# EAGLE design localization-daughter-board (EAGLE 8.6.0)
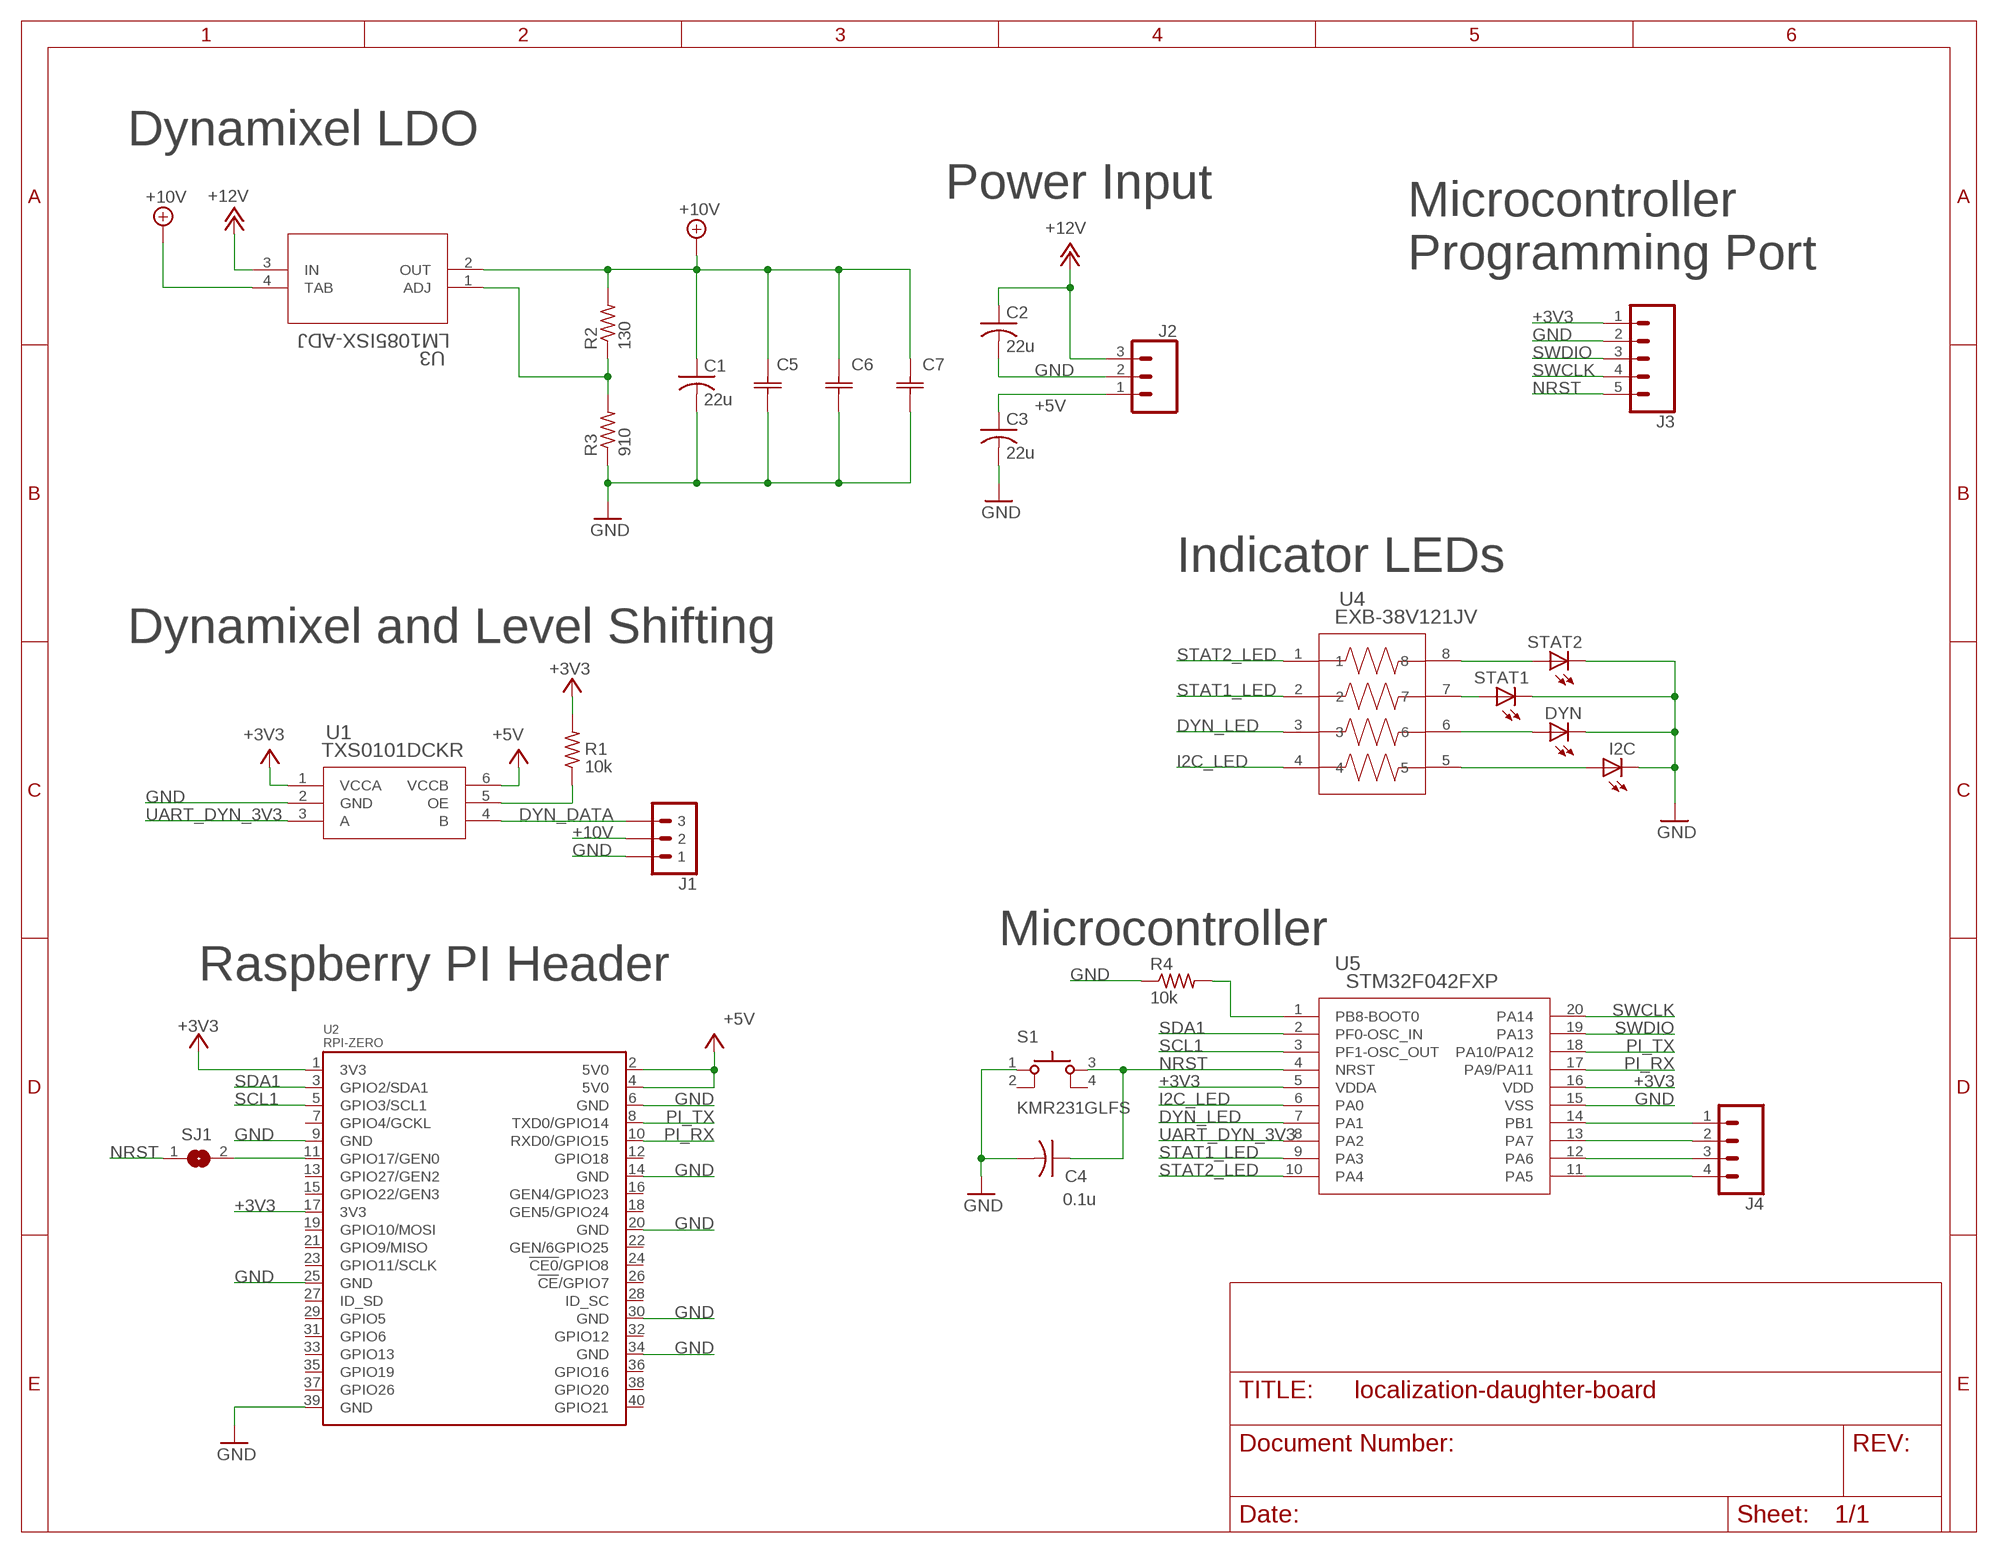
[diagram p0: schematic, sheet 1]

## Parts
C1  22u  C-USC1206  [C1206]
C2  22u  C-USC0805  [C0805]
C3  22u  C-USC0805  [C0805]
C4  0.1u  C-USC0805  [C0805]
C5  F931C107MCC  [F93-C]
C6  F931C107MCC  [F93-C]
C7  F931C107MCC  [F93-C]
DYN  LEDSML0603  [SML0603]
I2C  LEDSML0603  [SML0603]
J1  MOLEX-22-03-5035  [MOLEX-22-05-7035]
J2  CONN_03JST-PTH  [JST-3-PTH]
J3  CONN_05JST-VERT  [JST-5-PTH-VERT]
J4  CONN_041X04_NO_SILK  [1X04_NO_SILK]
R1  10k  R-US_R0805  [R0805]
R2  130  R-US_R0805  [R0805]
R3  910  R-US_R0805  [R0805]
R4  10k  R-US_R0805  [R0805]
S1  KMR231GLFS  [KMR231GLFS]
SJ1  SJ  [SJ]
STAT1  LEDSML0603  [SML0603]
STAT2  LEDSML0603  [SML0603]
U1  TXS0101DCKR  [DCK6]
U2  RPI-ZERO  [RASPBERRYPI_BASTELSTUBE_V13_RASPI_BOARD_B+_FULL]
U3  LM1085ISX-ADJ  [TS3B]
U4  EXB-38V121JV  [C_ARRAY_EXB38V]
U5  STM32F042FXP  [TSSOP20]

## Nets
+3V3: J3.1 R1.2 U1.1(VCCA) U2.1(3V3) U2.17(3V3) U5.5(VDDA) U5.16(VDD)
+5V: C3.1 J2.1 U1.6(VCCB) U2.2(5V0) U2.4(5V0)
+10V: C1.1 C5.1 C6.1 C7.1 J1.P$2 R2.2 U3.2(OUT) U3.4(TAB)
+12V: C2.1 J2.3 U3.3(IN)
DYN_DATA: J1.P$3 U1.4(B)
DYN_LED: U4.3 U5.7(PA1)
DYN_OE: R1.1 U1.5(OE)
GND: C1.2 C2.2 C3.2 C4.2 C5.2 C6.2 C7.2 DYN.C I2C.C J1.P$1 J2.2 J3.2 R3.1 R4.1 S1.1 STAT1.C STAT2.C U1.2(GND) U2.6(GND) U2.9(GND) U2.14(GND) U2.20(GND) U2.25(GND) U2.30(GND) U2.34(GND) U2.39(GND) U5.15(VSS)
I2C_LED: U4.4 U5.6(PA0)
N$1: R4.2 U5.1(PB8-BOOT0)
N$2: STAT1.A U4.7
N$3: R2.1 R3.2 U3.1(ADJ)
N$4: DYN.A U4.6
N$5: I2C.A U4.5
N$6: STAT2.A U4.8
N$7: J4.1 U5.14(PB1)
N$8: J4.2 U5.13(PA7)
N$9: J4.3 U5.12(PA6)
N$10: J4.4 U5.11(PA5)
NRST: C4.1 J3.5 S1.3 SJ1.1 U5.4(NRST)
PI_NRST: SJ1.2 U2.11(GPIO17/GEN0)
PI_RX: U2.10(RXD0/GPIO15) U5.17(PA9/PA11)
PI_TX: U2.8(TXD0/GPIO14) U5.18(PA10/PA12)
SCL1: U2.5(GPIO3/SCL1) U5.3(PF1-OSC_OUT)
SDA1: U2.3(GPIO2/SDA1) U5.2(PF0-OSC_IN)
STAT1_LED: U4.2 U5.9(PA3)
STAT2_LED: U4.1 U5.10(PA4)
SWCLK: J3.4 U5.20(PA14)
SWDIO: J3.3 U5.19(PA13)
UART_DYN_3V3: U1.3(A) U5.8(PA2)
Unconnected: S1.2 S1.4 U2.7(GPIO4/GCKL) U2.12(GPIO18) U2.13(GPIO27/GEN2) U2.15(GPIO22/GEN3) U2.16(GEN4/GPIO23) U2.18(GEN5/GPIO24) U2.19(GPIO10/MOSI) U2.21(GPIO9/MISO) U2.22(GEN/6GPIO25) U2.23(GPIO11/SCLK) U2.24(!CE0!/GPIO8) U2.26(!CE!/GPIO7) U2.27(ID_SD) U2.28(ID_SC) U2.29(GPIO5) U2.31(GPIO6) U2.32(GPIO12) U2.33(GPIO13) U2.35(GPIO19) U2.36(GPIO16) U2.37(GPIO26) U2.38(GPIO20) U2.40(GPIO21)

## Notes on the sheet
- Dynamixel LDO
- Power Input
- Microcontroller
  Programming Port
- Indicator LEDs
- Dynamixel and Level Shifting
- Microcontroller
- Raspberry PI Header

## Library data of the parts
C1-C4 = resistor:C-US: CAPACITOR, American symbol
C5-C7 = Localization-Daughter-Board:F931C107MCC; MANUFACTURER_PART_NUMBER: F931C107MCC; VENDOR: AVX Corporation
DYN I2C STAT1 STAT2 = led:LED: LED OSRAM: - CHIPLED LG R971, LG N971, LY N971, LG Q971, LY Q971, LO R971, LY R971 LH N974, LH R974 LS Q976, LO Q976, LY Q976 LO Q996 - Hyper CHIPLED LW Q18S LB Q993, LB Q99A, LB R99A - SideLED LS A670, LO A670, LY A670, LG A670, LP A670 LB A673, LV A673, LT A673, LW A673 LH A674 LY A675 LS A676, LA A676, LO A676, LY A676, LW A676 LS A679, LY A679, LG A679 - Hyper Micro SIDELED® LS Y876, LA Y876, LO Y876, LY Y876 LT Y87S - SmartLED LW L88C, LW L88S LB L89C, LB L89S, LG L890 LS L89K, LO L89K, LY L89K LS L896, LA L896, LO L896, LY L896 - TOPLED LS T670, LO T670, LY T670, LG T670, LP T670 LSG T670, LSP T670, LSY T670, LOP T670, LYG T670 LG T671, LOG T671, LSG T671 LB T673, LV T673, LT T673, LW T673 LH T674 LS T676, LA T676, LO T676, LY T676, LB T676, LH T676, LSB T676, LW T676 LB T67C, LV T67C, LT T67C, LS T67K, LO T67K, LY T67K, LW E67C LS E67B, LA E67B, LO E67B, LY E67B, LB E67C, LV E67C, LT E67C LW T67C LS T679, LY T679, LG T679 LS T770, LO T770, LY T770, LG T770, LP T770 LB T773, LV T773, LT T773, LW T773 LH T774 LS E675, LA E675, LY E675, LS T675 LS T776, LA T776, LO T776, LY T776, LB T776 LHGB T686 LT T68C, LB T68C - Hyper Mini TOPLED® LB M676 - Mini TOPLED Santana® LG M470 LS M47K, LO M47K, LY M47K Source: http://www.osram.convergy.de LUXEON: - LUMILED® LXK2-PW12-R00, LXK2-PW12-S00, LXK2-PW14-U00, LXK2-PW14-V00 LXK2-PM12-R00, LXK2-PM12-S00, LXK2-PM14-U00 LXK2-PE12-Q00, LXK2-PE12-R00, LXK2-PE12-S00, LXK2-PE14-T00, LXK2-PE14-U00 LXK2-PB12-K00, LXK2-PB12-L00, LXK2-PB12-M00, LXK2-PB14-N00, LXK2-PB14-P00, LXK2-PB14-Q00 LXK2-PR12-L00, LXK2-PR12-M00, LXK2-PR14-Q00, LXK2-PR14-R00 LXK2-PD12-Q00, LXK2-PD12-R00, LXK2-PD12-S00 LXK2-PH12-R00, LXK2-PH12-S00 LXK2-PL12-P00, LXK2-PL12-Q00, LXK2-PL12-R00 Source: www.luxeon.com KINGBRIGHT: KA-3528ASYC Source: www.kingbright.com
J1 = bbb_localization_cape:MOLEX-22-03-5035: MOLEX, LLC 22-03-5035
J2 = SparkFun-Connectors:CONN_03: Multi connection point. Often used as Generic Header-pin footprint for 0.1 inch spaced/style header connections On any of the 0.1 inch spaced packages, you can populate with these: Break Away Headers - Straight <https://www.sparkfun.com/products/116> (PRT-00116) Break Away Male Headers - Right Angle <https://www.sparkfun.com/products/553> (PRT-00553) Female Headers <https://www.sparkfun.com/products/115> (PRT-00115) Break Away Headers - Machine Pin <https://www.sparkfun.com/products/117> (PRT-00117) Break Away Female Headers - Swiss Machine Pin <https://www.sparkfun.com/products/743> (PRT-00743) Stackable Header - 3 Pin (Female, 0.1") <https://www.sparkfun.com/products/13875> (PRT-13875) For SCREWTERMINALS and SPRING TERMINALS visit here: Screw Terimnals on SparkFun.com <https://www.sparkfun.com/search/results?term=Screw+Terminals> (5mm/3.5mm/2.54mm spacing) This device is also useful as a general connection point to wire up your design to another part of your project. Our various solder wires solder well into these plated through hole pads. Hook-Up Wire - Assortment (Stranded, 22 AWG) <https://www.sparkfun.com/products/11375> (PRT-11375) Hook-Up Wire - Assortment (Solid Core, 22 AWG) <https://www.sparkfun.com/products/11367> (PRT-11367) View the entire wire category on our website here <https://www.sparkfun.com/categories/141> Special notes: Molex polarized connector foot print use with SKU : PRT-08232 with associated crimp pins and housings.; PROD_ID: WIRE-10037; SF_ID: PRT-09915
J3 = SparkFun-Connectors:CONN_05: Multi connection point. Often used as Generic Header-pin footprint for 0.1 inch spaced/style header connections On any of the 0.1 inch spaced packages, you can populate with these: Break Away Headers - Straight <https://www.sparkfun.com/products/116> (PRT-00116) Break Away Male Headers - Right Angle <https://www.sparkfun.com/products/553> (PRT-00553) Female Headers <https://www.sparkfun.com/products/115> (PRT-00115) Break Away Headers - Machine Pin <https://www.sparkfun.com/products/117> (PRT-00117) Break Away Female Headers - Swiss Machine Pin <https://www.sparkfun.com/products/743> (PRT-00743) For SCREWTERMINALS and SPRING TERMINALS visit here: Screw Terimnals on SparkFun.com <https://www.sparkfun.com/search/results?term=Screw+Terminals> (5mm/3.5mm/2.54mm spacing) This device is also useful as a general connection point to wire up your design to another part of your project. Our various solder wires solder well into these plated through hole pads. Hook-Up Wire - Assortment (Stranded, 22 AWG) <https://www.sparkfun.com/products/11375> (PRT-11375) Hook-Up Wire - Assortment (Solid Core, 22 AWG) <https://www.sparkfun.com/products/11367> (PRT-11367) View the entire wire category on our website here <https://www.sparkfun.com/categories/141> Special notes: Molex polarized connector foot print use with SKU : PRT-08231 with associated crimp pins and housings. 1MM SMD Version SKU: PRT-10208
J4 = SparkFun-Connectors:CONN_04: Multi connection point. Often used as Generic Header-pin footprint for 0.1 inch spaced/style header connections On any of the 0.1 inch spaced packages, you can populate with these: Break Away Headers - Straight <https://www.sparkfun.com/products/116> (PRT-00116) Break Away Male Headers - Right Angle <https://www.sparkfun.com/products/553> (PRT-00553) Female Headers <https://www.sparkfun.com/products/115> (PRT-00115) Break Away Headers - Machine Pin <https://www.sparkfun.com/products/117> (PRT-00117) Break Away Female Headers - Swiss Machine Pin <https://www.sparkfun.com/products/743> (PRT-00743) For SCREWTERMINALS and SPRING TERMINALS visit here: Screw Terimnals on SparkFun.com <https://www.sparkfun.com/search/results?term=Screw+Terminals> (5mm/3.5mm/2.54mm spacing) This device is also useful as a general connection point to wire up your design to another part of your project. Our various solder wires solder well into these plated through hole pads. Hook-Up Wire - Assortment (Stranded, 22 AWG) <https://www.sparkfun.com/products/11375> (PRT-11375) Hook-Up Wire - Assortment (Solid Core, 22 AWG) <https://www.sparkfun.com/products/11367> (PRT-11367) View the entire wire category on our website here <https://www.sparkfun.com/categories/141> Special notes: Molex polarized connector foot print use with SKU : PRT-08231 with associated crimp pins and housings. 1MM SMD Version SKU: PRT-10208; PROD_ID: CONN-09696
R1-R4 = resistor:R-US_: RESISTOR, American symbol
S1 = Localization-Daughter-Board:KMR231GLFS
SJ1 = jumper:SJ: SMD solder JUMPER
U1 = Localization-Daughter-Board:TXS0101DCKR; MANUFACTURER_PART_NUMBER: TXS0101DCKR; VENDOR: Texas Instruments
U2 = RPI-Zero:RPI-ZERO
U3 = bbb_localization_cape:LM1085ISX-ADJ: Adjustable Linear Voltage Regulator; MANUFACTURER_PART_NUMBER: lm1085isxadj; VENDOR: Texas Instruments
U4 = Localization-Daughter-Board:EXB-38V121JV; MANUFACTURER_PART_NUMBER: EXB38V121JV; VENDOR: Panasonic
U5 = Localization-Daughter-Board:STM32F042FXP; MANUFACTURER_PART_NUMBER: STM32F042FxP; VENDOR: STMicroelectronics

## Board
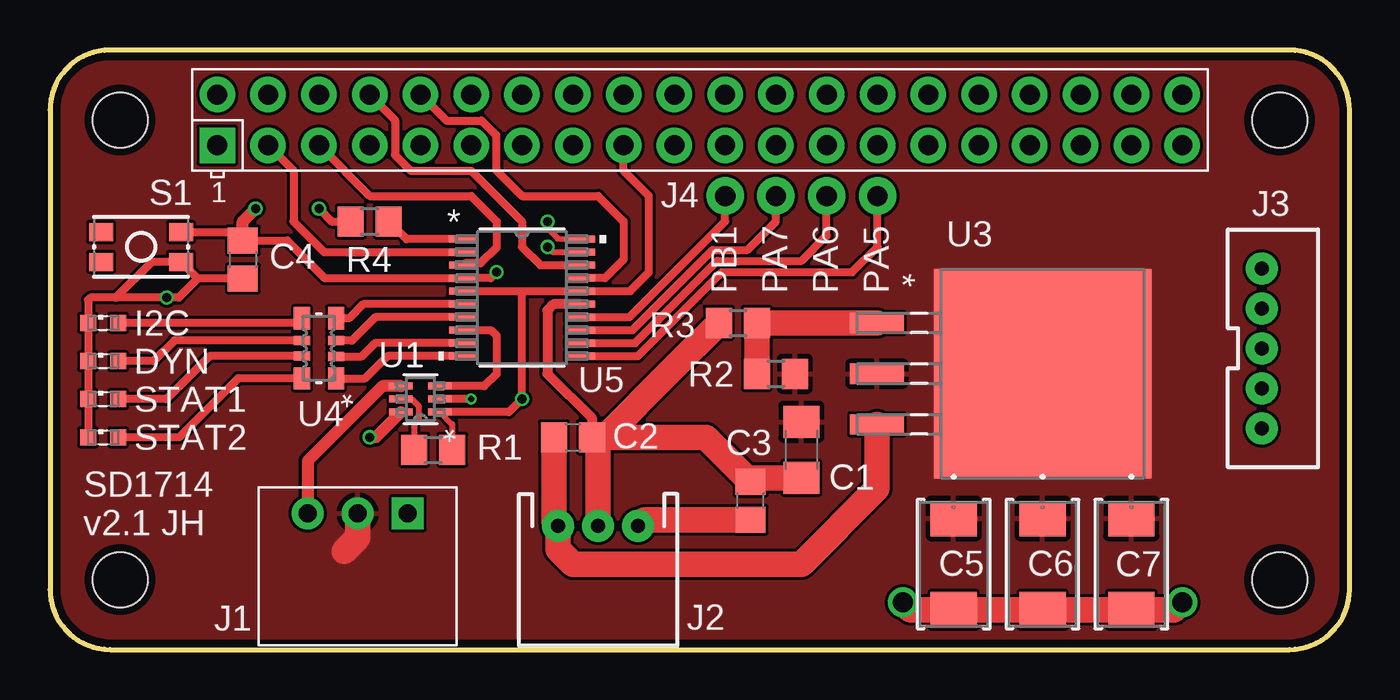
[diagram p1: board, top side]
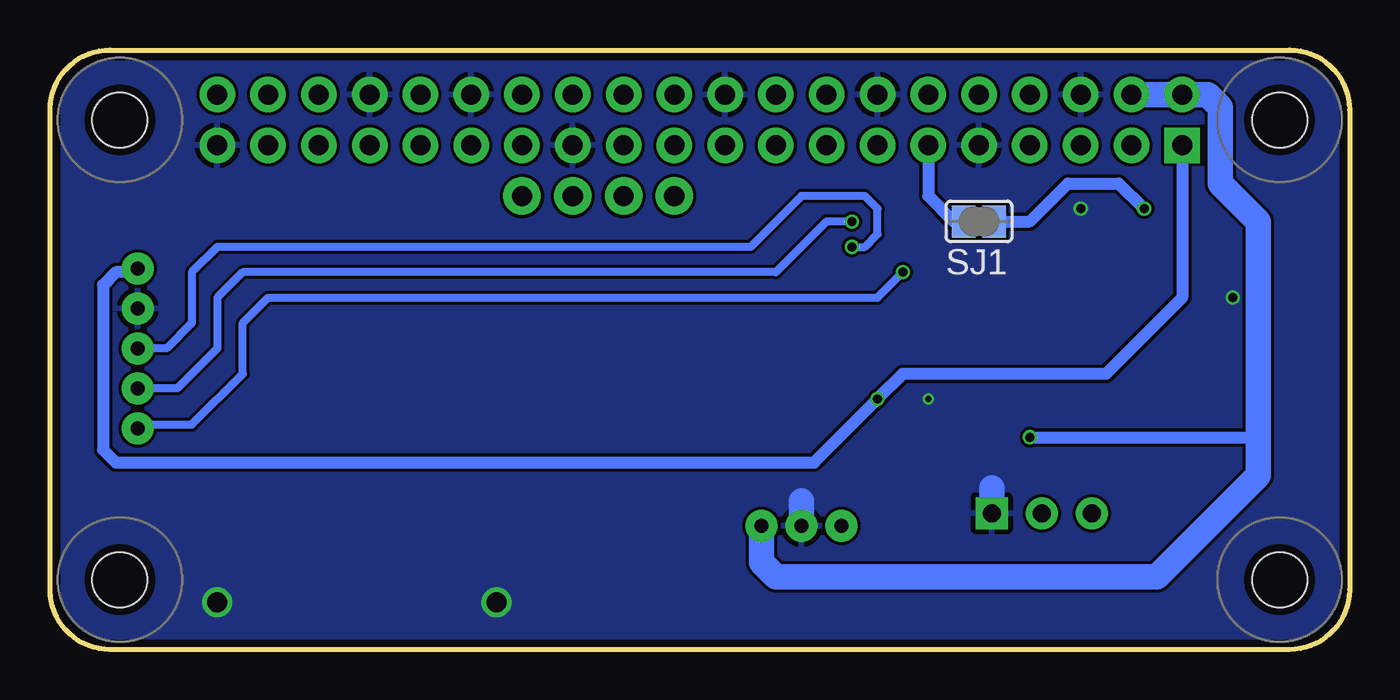
[diagram p2: board, bottom side, seen from below]

Size 65 x 30 mm. Coordinates in mm from the lower left corner, seen from the top.
Outline: 0,27 0,3 arc90 3,0 62,0 arc90 65,3 65,27 arc90 62,30 3,30 arc90 0,27
Copper layers (1*16): Top 0.035559375mm / dielectric 1.6mm / Bottom 0.035559375mm
Design rules "oshpark-2layer": minimum track width 6mil, minimum drill 10mil, track to track 6mil, track to pad 6mil, pad to pad 6mil, via to via 6mil, smd to smd 6mil, copper to edge 15mil, drill to drill 6mil, minimum pad ring 5mil, minimum via ring 5mil, stop-mask expansion 2.5mil, vias tented up to drill 0mil, thermal gap 10mil

### Footprints (pad centres in the part's own frame; a part is rotated, then mirrored left to right if it is on the bottom)
C1206 = smd 1.6 x 1.8: 1 -1.4,0; 2 1.4,0
C0805 = smd 1.3 x 1.5: 1 -0.95,0; 2 0.95,0
F93-C = smd 1.778 x 2.311: 1 -2.286,0; 2 2.286,0
SML0603 = smd 0.8 x 0.8: A 0.75,0; C -0.75,0
MOLEX-22-05-7035 = drill 0.9 pad 1.6 square: P$1 0,0 | drill 0.9 pad 1.6: P$2 2.5,0; P$3 5,0
JST-3-PTH = drill 0.7 pad 1.6: 1 -2,0; 2 0,0; 3 2,0
JST-5-PTH-VERT = drill 0.7 pad 1.6: 1 -4,0.18; 2 -2,0.18; 3 0,0.18; 4 2,0.18; 5 4,0.18
1X04_NO_SILK = drill 1.016 pad 1.88: 1 0,0; 2 2.54,0; 3 5.08,0; 4 7.62,0
R0805 = smd 1.3 x 1.5: 1 -0.95,0; 2 0.95,0
KMR231GLFS = smd 1.2 x 0.9: 1 -2,0.75; 2 2,0.75; 3 -2,-0.75; 4 2,-0.75
SJ = smd 1.168 x 1.6: 1 -0.762,0; 2 0.762,0
DCK6 = smd 1.168 x 0.356: 1 -0.978,0.65; 2 -0.978,0; 3 -0.978,-0.65; 4 0.978,-0.65; 5 0.978,0; 6 0.978,0.65
RASPBERRYPI_BASTELSTUBE_V13_RASPI_BOARD_B+_FULL = drill 1 pad 1.778 square: 1 8.37,25.23 | drill 1 pad 1.778: 2 8.37,27.77; 3 10.91,25.23; 4 10.91,27.77; 5 13.45,25.23; 6 13.45,27.77; 7 15.99,25.23; 8 15.99,27.77; 9 18.53,25.23; 10 18.53,27.77; 11 21.07,25.23; 12 21.07,27.77; 13 23.61,25.23; 14 23.61,27.77; 15 26.15,25.23; 16 26.15,27.77; 17 28.69,25.23; 18 28.69,27.77; 19 31.23,25.23; 20 31.23,27.77; 21 33.77,25.23; 22 33.77,27.77; 23 36.31,25.23; 24 36.31,27.77; 25 38.85,25.23; 26 38.85,27.77; 27 41.39,25.23; 28 41.39,27.77; 29 43.93,25.23; 30 43.93,27.77; 31 46.47,25.23; 32 46.47,27.77; 33 49.01,25.23; 34 49.01,27.77; 35 51.55,25.23; 36 51.55,27.77; 37 54.09,25.23; 38 54.09,27.77; 39 56.63,25.23; 40 56.63,27.77 | hole 2.75: 3.5,3.5; 3.5,26.5; 61.5,3.5; 61.5,26.5
TS3B = smd 1.016 x 2.692: 1 -2.54,-8.28; 2 0,-8.28; 3 2.54,-8.28 | smd 10.465 x 10.871: 4 0,0
C_ARRAY_EXB38V = smd 0.807 x 1.107: 1 -0.854,1.504; 4 -0.854,-1.504; 5 0.854,-1.504; 8 0.854,1.504 | smd 0.807 x 0.45: 2 -0.854,0.395; 3 -0.854,-0.385; 6 0.854,-0.395; 7 0.854,0.385
TSSOP20 = smd 1.473 x 0.356: 1 -2.921,2.925; 2 -2.921,2.275; 3 -2.921,1.625; 4 -2.921,0.975; 5 -2.921,0.325; 6 -2.921,-0.325; 7 -2.921,-0.975; 8 -2.921,-1.625; 9 -2.921,-2.275; 10 -2.921,-2.925; 11 2.921,-2.925; 12 2.921,-2.275; 13 2.921,-1.625; 14 2.921,-0.975; 15 2.921,-0.325; 16 2.921,0.325; 17 2.921,0.975; 18 2.921,1.625; 19 2.921,2.275; 20 2.921,2.925

### Placement (x,y rotation side)
C1  37.58,9.99 270 top
C2  26.15,10.62 0 top
C3  35.04,7.45 90 top
C4  9.64,19.51 270 top
C5  45.2,4.28 270 top
C6  49.64,4.28 270 top
C7  54.09,4.28 270 top
DYN  2.65,14.44 0 top
I2C  2.65,16.34 0 top
J1  17.89,6.82 180 top
J2  27.42,6.18 180 top
J3  60.44,15.07 270 top
J4  33.77,22.69 0 top
R1  19.16,9.99 0 top
R2  36.31,13.8 0 top
R3  34.4,16.34 0 top
R4  15.99,21.42 0 top
S1  4.56,20.15 180 top
SJ1  18.53,21.42 180 bottom
STAT1  2.65,12.53 0 top
STAT2  2.65,10.62 0 top
U1  18.53,12.53 180 top
U2  0,0 0 top
U3  49.64,13.8 270 top
U4  13.45,15.07 180 top
U5  23.61,17.61 0 top

### Tracks (layer width: path | path; a pad name or v marks a point on that pad's centre or on a via)
+3V3  (via drill 0.45)
  Top 0.305: U1.1 20.12,11.27 R1.2
  Top 0.406: U1.1 22.96,11.88 v23.61,12.53 23.61,17.93 | U5.5 23.29,17.93 | 23.29,17.93 | 23.29,17.93 23.61,17.93 | 23.61,17.93 U5.16 29.02,17.93 29.96,18.88 29.96,22.69 28.69,23.96 U2.17
  Bottom 0.61: U2.1 8.37,17.61 12.18,13.8 22.34,13.8 v23.61,12.53 26.79,9.36 61.71,9.36 62.34,9.99 62.34,18.24 61.71,18.88 60.81,18.88 J3.1
+5V  (via drill 0.45)
  Top 0.61: U1.6 16.3,10.62 v15.99,10.62
  Top 1.27: J2.1 29.73,6.5 C3.1
  Bottom 0.61: v15.99,10.62 4.56,10.62
  Bottom 1.27: U2.4 U2.2 7.1,27.77 6.46,27.13 6.46,23.32 4.56,21.42 4.56,10.62 4.56,8.72 9.64,3.64 28.69,3.64 29.42,4.37 J2.1
+10V
  Top 1.27: J1.P$2 15.39,5.58 14.72,4.91
  pour Top (rank 2): 0,27 arc-90 3,30 62,30 arc-90 65,27 65,3 arc-90 62,0 3,0 arc-90 0,3
  pour Top (rank 2, no thermals): 43.93,19.51 55.36,19.51 55.36,8.09 43.93,8.09
+12V
  Top 1.27: C2.1 25.2,6.4 J2.3 25.42,5 26.15,4.28 37.58,4.28 41.36,8.06 U3.3
DYN_DATA
  Top 0.61: U1.4 16.64,13.18 12.89,9.44 J1.P$3
DYN_LED
  Top 0.406: U5.7 16.29,16.63 15.11,15.46 U4.3
DYN_OE
  Top 0.305: R1.1 18.21,11.35 18.44,11.58 18.44,12.18 18.09,12.53 U1.5
GND  (via drill 0.3, 0.45, 1)
  Top 0.406: C4.2 7.39,18.56 | 7.39,18.56 S1.1 5.08,19.4 3.29,17.61 | 3.29,17.61 2.02,17.61 1.9,17.49 I2C.C DYN.C STAT1.C STAT2.C | 3.29,17.61 v5.83,17.61 6.44,17.61 7.39,18.56 | v21.07,12.53 U1.2 | v13.45,22.05 14.09,21.42 R4.1
  Top 0.508: 31.23,14.12 31.07,13.96 | U5.15 25.19,17.28 24.88,16.97 24.88,13.8 27.1,11.58 C2.2
  Top 1.27: R3.1 31.07,13.96 27.74,10.62 C2.2 | C2.2 27.42,10.3 J2.2 | C1.2 35.23,8.59 C3.2 32.81,10.62 C2.2 | v42.66,2.37 43.04,1.99 C5.2 C6.2 C7.2 56.25,1.99 v56.63,2.37
  Bottom 1.27: J2.2 27.42,7.45 | J1.P$1 17.89,8.09
  pour Bottom: 0,27 arc-90 3,30 62,30 arc-90 65,27 65,3 arc-90 62,0 3,0 arc-90 0,3
I2C_LED
  Top 0.406: U4.4 14.95,16.57 15.66,17.28 U5.6
N$1
  Top 0.406: U5.1 17.82,20.53 R4.2
N$2
  Top 0.406: U4.7 7.99,14.69 5.83,12.53 STAT1.A
N$3
  Top 1.27: U3.1 R3.2 R2.1
N$4
  Top 0.406: U4.6 6.22,15.46 5.2,14.44 DYN.A
N$5
  Top 0.406: U4.5 12.36,16.34 I2C.A
N$6
  Top 0.406: U4.8 9.41,13.57 6.46,10.62 STAT2.A
N$7
  Top 0.406: U5.14 28.98,16.63 33.77,21.42 J4.1
N$8
  Top 0.406: U5.13 29.12,15.99 33.14,20 34.89,20 36.31,21.42 J4.2
N$9
  Top 0.406: U5.12 29.27,15.34 33.37,19.44 37.58,19.44 38.85,20.71 J4.3
N$10
  Top 0.406: J4.4 41.39,20.15 40.12,18.88 33.6,18.88 29.41,14.69 U5.11
NRST  (via drill 0.45)
  Top 0.406: S1.3 9.21,20.9 C4.1 11.87,20.46 13.75,18.58 U5.4 22.05,18.58 v22.34,18.88
  Top 0.61: C4.1 9.64,21.42 v10.28,22.05
  Bottom 0.406: J3.5 60.43,11.26 57.9,11.26 55.36,13.8 55.36,16.34 54.09,17.61 23.61,17.61 v22.34,18.88
  Bottom 0.61: SJ1.1 15.99,21.42 14.09,23.32 11.54,23.32 v10.28,22.05
PI_NRST
  Bottom 0.61: U2.11 21.07,22.69 19.8,21.42 SJ1.2
PI_RX
  Top 0.406: U2.10 19.82,26.47 21.59,26.47 22.32,25.75 22.32,23.98 23.61,22.69 27.42,22.69 28.69,21.42 28.69,19.51 27.76,18.58 U5.17
PI_TX
  Top 0.406: U2.8 17.26,26.5 17.26,24.74 18.04,23.96 21.07,23.96 23.61,21.42 23.61,20.15 24.53,19.23 U5.18
SCL1
  Top 0.406: U2.5 15.99,22.69 21.07,22.69 22.34,21.42 22.34,20.12 21.55,19.33 20.78,19.33 U5.3
SDA1
  Top 0.406: U2.3 12.18,23.96 12.18,21.42 13.71,19.88 U5.2
STAT1_LED
  Top 0.406: U5.9 16.25,15.34 15.59,14.68 U4.2
STAT2_LED
  Top 0.406: U5.10 16.88,14.69 15.76,13.57 U4.1
SWCLK  (via drill 0.45)
  Top 0.305: v24.88,21.42 24.88,21.08 25.41,20.55 U5.20
  Bottom 0.406: v24.88,21.42 26.15,21.42 28.69,18.88 55.36,18.88 56.63,17.61 56.63,15.07 58.63,13.07 J3.4
SWDIO  (via drill 0.45)
  Top 0.305: U5.19 25.13,19.9 v24.88,20.15
  Bottom 0.406: J3.3 59.17,15.07 57.9,16.34 57.9,18.88 56.63,20.15 29.96,20.15 27.42,22.69 24.25,22.69 23.61,22.05 23.61,20.78 24.25,20.15 v24.88,20.15
UART_DYN_3V3
  Top 0.406: U5.8 22.06,15.99 22.34,15.71 22.34,13.8 21.72,13.18 U1.3

### Text on the board
tNames: PB1 | PA7 | PA6 | PA5 | SD1714 / v2.1 JH